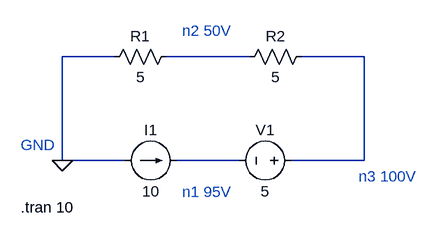
[diagram p0: schematic t5_sim.asc]
t5_sim.asc, the LTspice schematic file:
Version 4
SHEET 1 880 680
WIRE -16 112 -96 112
WIRE 192 112 64 112
WIRE 368 112 272 112
WIRE -96 272 -96 112
WIRE 0 272 -96 272
WIRE 176 272 80 272
WIRE 368 272 368 112
WIRE 368 272 256 272
FLAG -96 272 0
SYMBOL res 80 96 R90
WINDOW 0 0 56 VBottom 2
WINDOW 3 32 56 VTop 2
SYMATTR InstName R1
SYMATTR Value 5
SYMBOL res 288 96 R90
WINDOW 0 0 56 VBottom 2
WINDOW 3 32 56 VTop 2
SYMATTR InstName R2
SYMATTR Value 5
SYMBOL current 0 272 R270
WINDOW 0 32 40 VTop 2
WINDOW 3 -32 40 VBottom 2
WINDOW 123 0 0 Left 0
WINDOW 39 0 0 Left 0
SYMATTR InstName I1
SYMATTR Value 10
SYMBOL voltage 272 272 R90
WINDOW 0 -32 56 VBottom 2
WINDOW 3 32 56 VTop 2
SYMATTR InstName V1
SYMATTR Value 5
TEXT -160 248 Left 2 ;GND
TEXT -160 344 Left 2 !.tran 10
TEXT 88 320 Left 2 ;n1 95V
TEXT 88 72 Left 2 ;n2 50V
TEXT 360 296 Left 2 ;n3 100V

The netlist it stands for:
* t5_sim.asc
R1 N001 0 5
R2 N002 N001 5
I1 0 N003 10
V1 N002 N003 5
* GND
.tran 10
* n1 95V
* n2 50V
* n3 100V
.backanno
.end